# EAGLE design Moist_Detector (EAGLE 7.7.0)
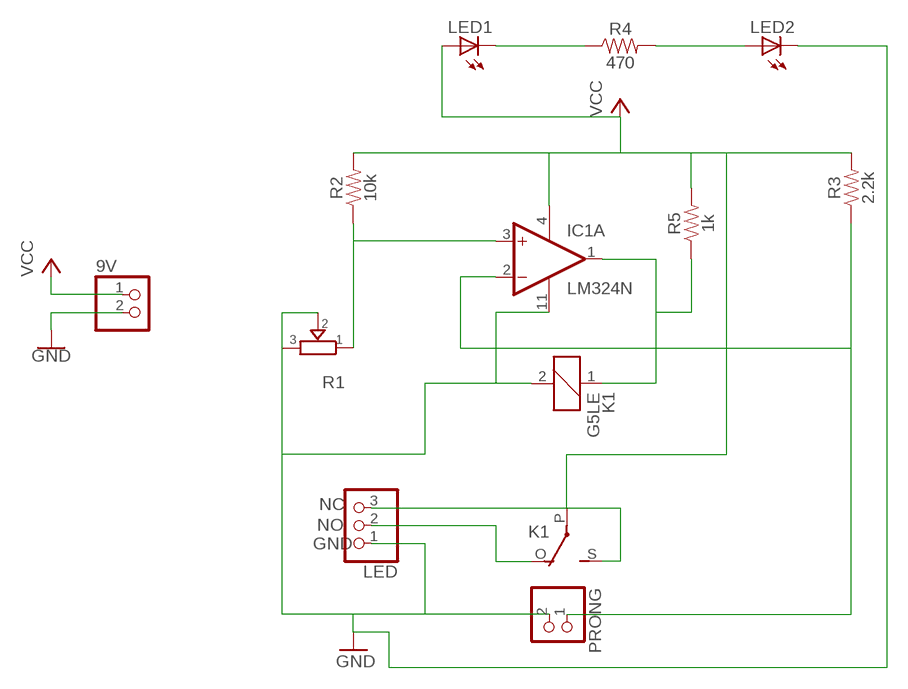
[diagram p0: schematic, sheet 1]

## Parts
9V  PINHD-1X2  [1X02]
IC1  LM324N  [DIL14]
K1  G5LE  [G5LE]
LED  PINHD-1X3  [1X03]
LED1  LED-5MM  [LED-5MM]
LED2  LED-5MM  [LED-5MM]
PRONG  PINHD-1X2  [1X02]
R1  TRIMMER-3306F  [TRIMMER_3306F]
R2  10k  10KOHM-HORIZ-1/4W-5%  [AXIAL-0.3]
R3  2.2k  1KOHM-HORIZ-1/4W-5%  [AXIAL-0.3]
R4  470  1KOHM-HORIZ-1/4W-5%  [AXIAL-0.3]
R5  1k  10KOHM-HORIZ-1/4W-5%  [AXIAL-0.3]

## Nets
GND: 9V.2 IC1.11(P:V-) K1.2 LED2.K(C) LED.1 PRONG.2 R1.2 R1.3
N$1: K1.O(2:O) LED.2
N$2: IC1.3(A:+IN) R1.1 R2.P$1
N$3: K1.S(2:S) LED.3
N$4: IC1.2(A:-IN) PRONG.1 R3.P$1
N$5: IC1.1(A:OUT) K1.1 R5.P$1
N$6: LED1.K(C) R4.P$1
N$7: LED2.A R4.P$2
VCC: 9V.1 IC1.4(P:V+) K1.P(2:P) LED1.A R2.P$2 R3.P$2 R5.P$2
Unconnected: IC1.5(B:+IN) IC1.6(B:-IN) IC1.7(B:OUT) IC1.8(C:OUT) IC1.9(C:-IN) IC1.10(C:+IN) IC1.12(D:+IN) IC1.13(D:-IN) IC1.14(D:OUT)

## Notes on the sheet
- NC
- NO
- GND

## Library data of the parts
9V PRONG = pinhead:PINHD-1X2: PIN HEADER
IC1 = linear:LM324: OP AMP
K1 = relay:G5LE: RELAY 1 x switch, 10 A/120 V AC, 8 A/30 V DC, Omron; OC_FARNELL: unknown; OC_NEWARK: unknown
LED = pinhead:PINHD-1X3: PIN HEADER
LED1 LED2 = dp_devices:LED: Light Emitting Diode
R1 = dp_devices:TRIMMER: Trimmer resistor
R2 = SparkFun-Resistors:10KOHM: 10kΩ resistor A resistor is a passive two-terminal electrical component that implements electrical resistance as a circuit element. Resistors act to reduce current flow, and, at the same time, act to lower voltage levels within circuits. - Wikipedia; PROD_ID: RES-09435
R3 R4 = SparkFun-Resistors:1KOHM: 1kΩ resistor A resistor is a passive two-terminal electrical component that implements electrical resistance as a circuit element. Resistors act to reduce current flow, and, at the same time, act to lower voltage levels within circuits. - Wikipedia; PROD_ID: RES-08380; VALUE: 1k
R5 = SparkFun-Resistors:10KOHM: 10kΩ resistor A resistor is a passive two-terminal electrical component that implements electrical resistance as a circuit element. Resistors act to reduce current flow, and, at the same time, act to lower voltage levels within circuits. - Wikipedia; PROD_ID: RES-09435; VALUE: 10k

## Board
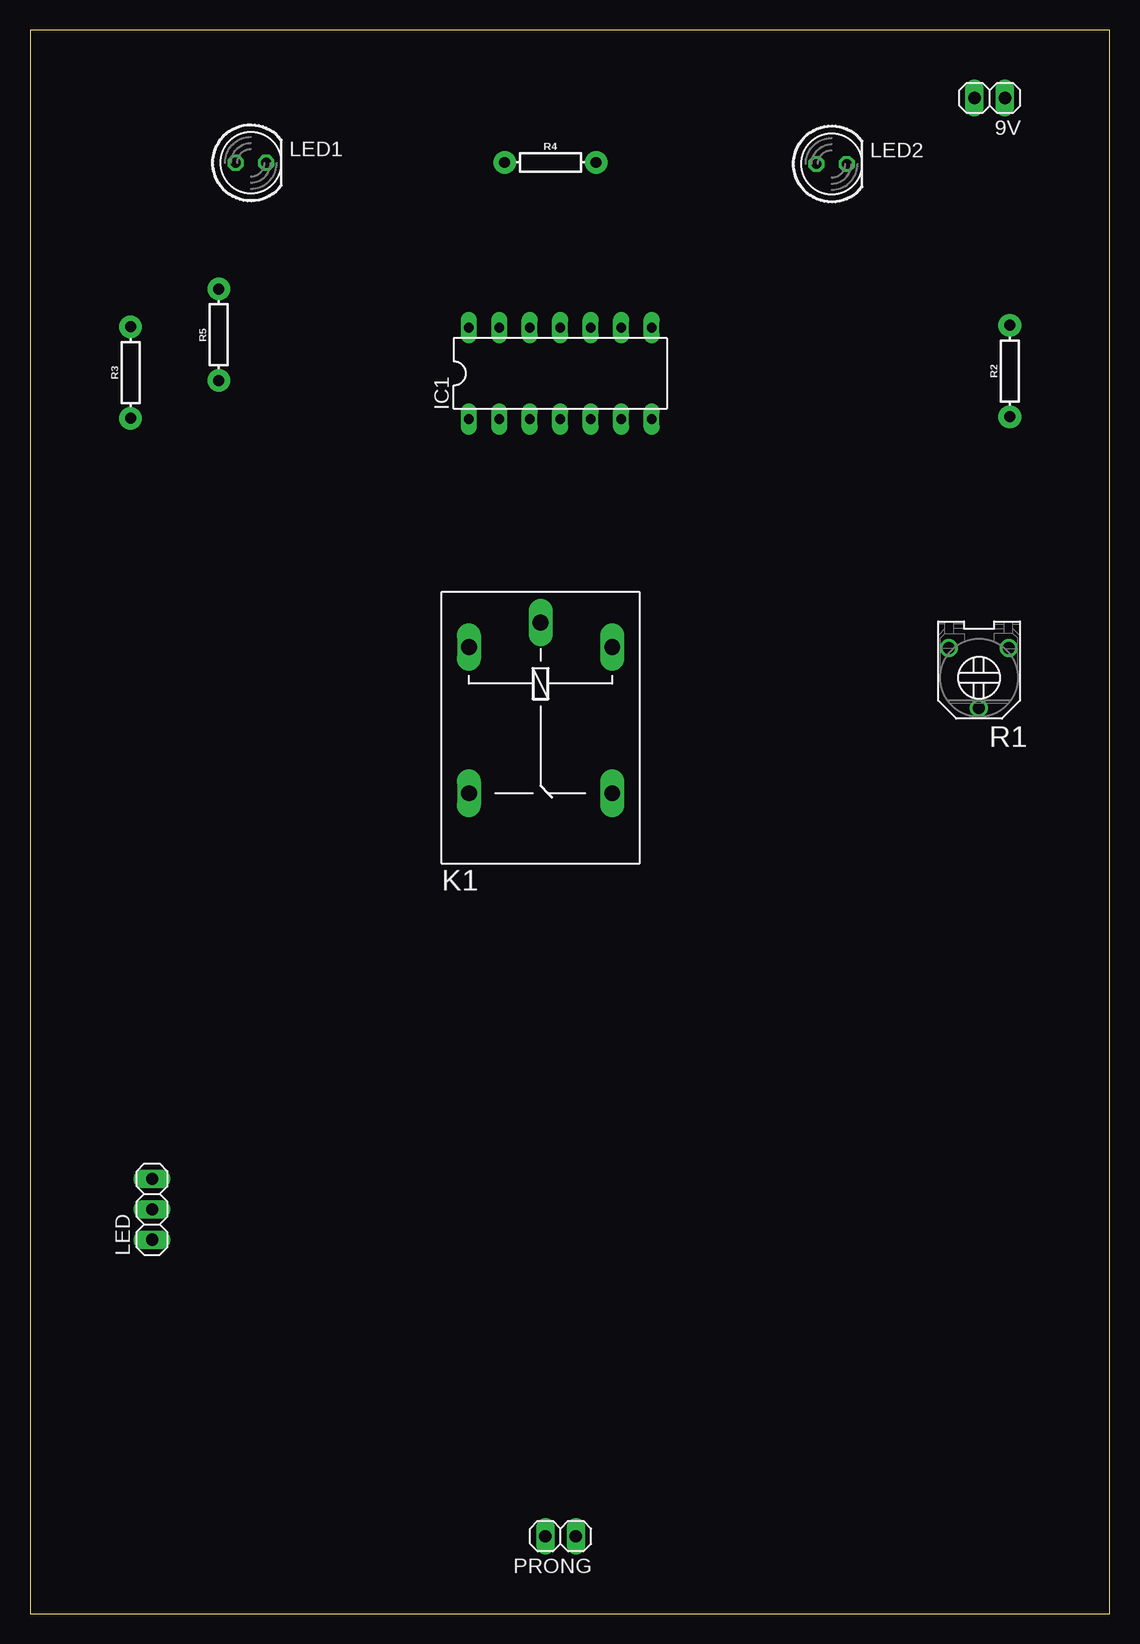
[diagram p1: board, top side]
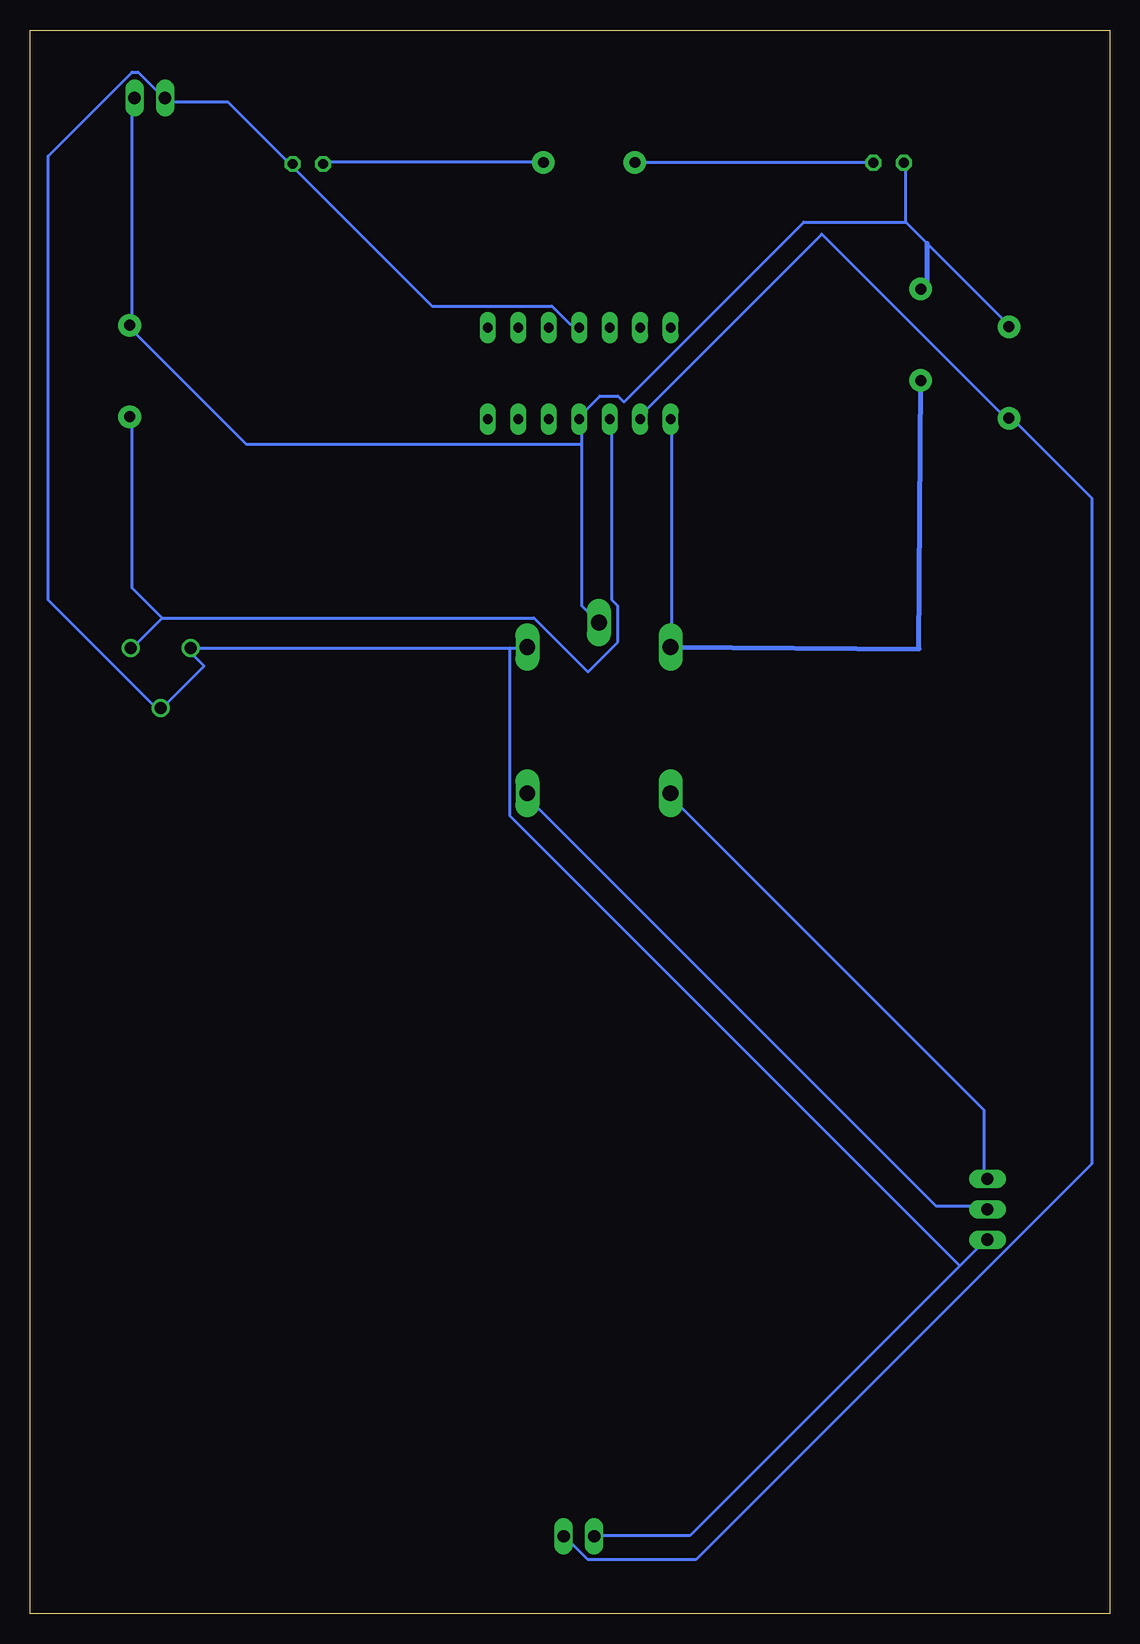
[diagram p2: board, bottom side, seen from below]

Size 90 x 132 mm. Coordinates in mm from the lower left corner, seen from the top.
Outline: 0,0 90,0 90,132 0,132 0,0
Copper layers (1*16): Top 0.035mm / dielectric 1.5mm / Bottom 0.035mm
Design rules "default": minimum track width 10mil, minimum drill 24mil, track to track 8mil, track to pad 8mil, pad to pad 8mil, via to via 8mil, smd to smd 8mil, copper to edge 40mil, drill to drill 8mil, minimum pad ring 10mil, minimum via ring 8mil, stop-mask expansion 4mil, vias tented up to drill 0mil, thermal gap 10mil

### Footprints (pad centres in the part's own frame; a part is rotated, then mirrored left to right if it is on the bottom)
1X02 = drill 1.016 long: 1 -1.27,0; 2 1.27,0
DIL14 = drill 0.813 long: 1 -7.62,-3.81; 2 -5.08,-3.81; 3 -2.54,-3.81; 4 0,-3.81; 5 2.54,-3.81; 6 5.08,-3.81; 7 7.62,-3.81; 8 7.62,3.81; 9 5.08,3.81; 10 2.54,3.81; 11 0,3.81; 12 -2.54,3.81; 13 -5.08,3.81; 14 -7.62,3.81
G5LE = drill 1.321 long: 1 -7.493,-5.969; 2 -7.493,5.969; O 4.699,5.969; P -9.525,0; S 4.699,-5.969
1X03 = drill 1.016 long: 1 -2.54,0; 2 0,0; 3 2.54,0
LED-5MM = drill 0.813 octagon: A -1.27,0; K 1.27,0
TRIMMER_3306F = drill 1: 1 -2.5,-2.5; 2 0,2.5; 3 2.5,-2.5
AXIAL-0.3 = drill 0.9 pad 1.88: P$1 -3.81,0; P$2 3.81,0

### Placement (x,y rotation side)
9V  80.02,126.33 180 top
IC1  44.21,103.37 0 top
K1  42.57,73.07 270 top
LED  10.18,33.7 90 top
LED1  18.42,120.93 0 top
LED2  66.83,120.83 0 top
PRONG  44.23,6.45 180 top
R1  79.12,77.99 180 top
R2  81.69,103.58 90 top
R3  8.39,103.45 90 top
R4  43.38,120.96 0 top
R5  15.73,106.59 90 top

### Tracks (layer width: path | path; a pad name or v marks a point on that pad's centre or on a via)
GND
  Bottom 0.254: IC1.11 44.5,107.5 45,107.5 46.5,109 56.5,109 68,120.5 LED2.K 68.5,121 73.5,126 78.5,126 9V.2 79,126.5 81,128.5 81.5,128.5 88.5,121.5 88.5,84.5 79.5,75.5 R1.2 79,75.5 75.5,79 76.5,80 R1.3 76.5,80.5 50,80.5 | 50,80.5 49,80.5 K1.2 | 12.5,29 10.5,31 LED.1 | 12.5,29 35,6.5 42.5,6.5 PRONG.2 | 50,80.5 50,66.5 12.5,29
N$1
  Bottom 0.254: LED.2 10.5,34 14.5,34 48.5,68 K1.O
N$2
  Bottom 0.254: 79,83 48,83 43.5,78.5 41,81 41,84 41.5,84.5 41.5,99.5 IC1.3 | 79,83 81.5,80.5 R1.1 | 79,83 81.5,85.5 81.5,99.5 R2.P$1
N$3
  Bottom 0.254: LED.3 10.5,36.5 10.5,42 36.5,68 K1.S
N$4
  Bottom 0.254: IC1.2 39,100 24,115 8.5,99.5 R3.P$1 8,99.5 1.5,93 1.5,37.5 34.5,4.5 43.5,4.5 45,6 45.5,6 PRONG.1
N$5
  Bottom 0.254: IC1.1 36.5,99.5 36.5,81 K1.1
  Bottom 0.406: K1.1 15.89,80.41 R5.P$1
N$6
  Bottom 0.254: LED1.K 20,121 39.5,121 R4.P$1
N$7
  Bottom 0.254: LED2.A 65.5,121 47.5,121 R4.P$2
VCC
  Bottom 0.254: 17,116 17,120.5 LED1.A | 17,116 15.21,114.2 8.5,107.5 R3.P$2 | 44,97.5 44,84 43,83 K1.P | 44,97.5 44,99.5 IC1.4 44,100 42.5,101.5 41,101.5 40.5,101 25.5,116 17,116 | 9V.1 81.5,126 81.5,107.5 R2.P$2 81.5,107 72,97.5 44,97.5
  Bottom 0.406: R5.P$2 15.21,110.4 15.21,114.2